# Altium project LED.PrjPcb
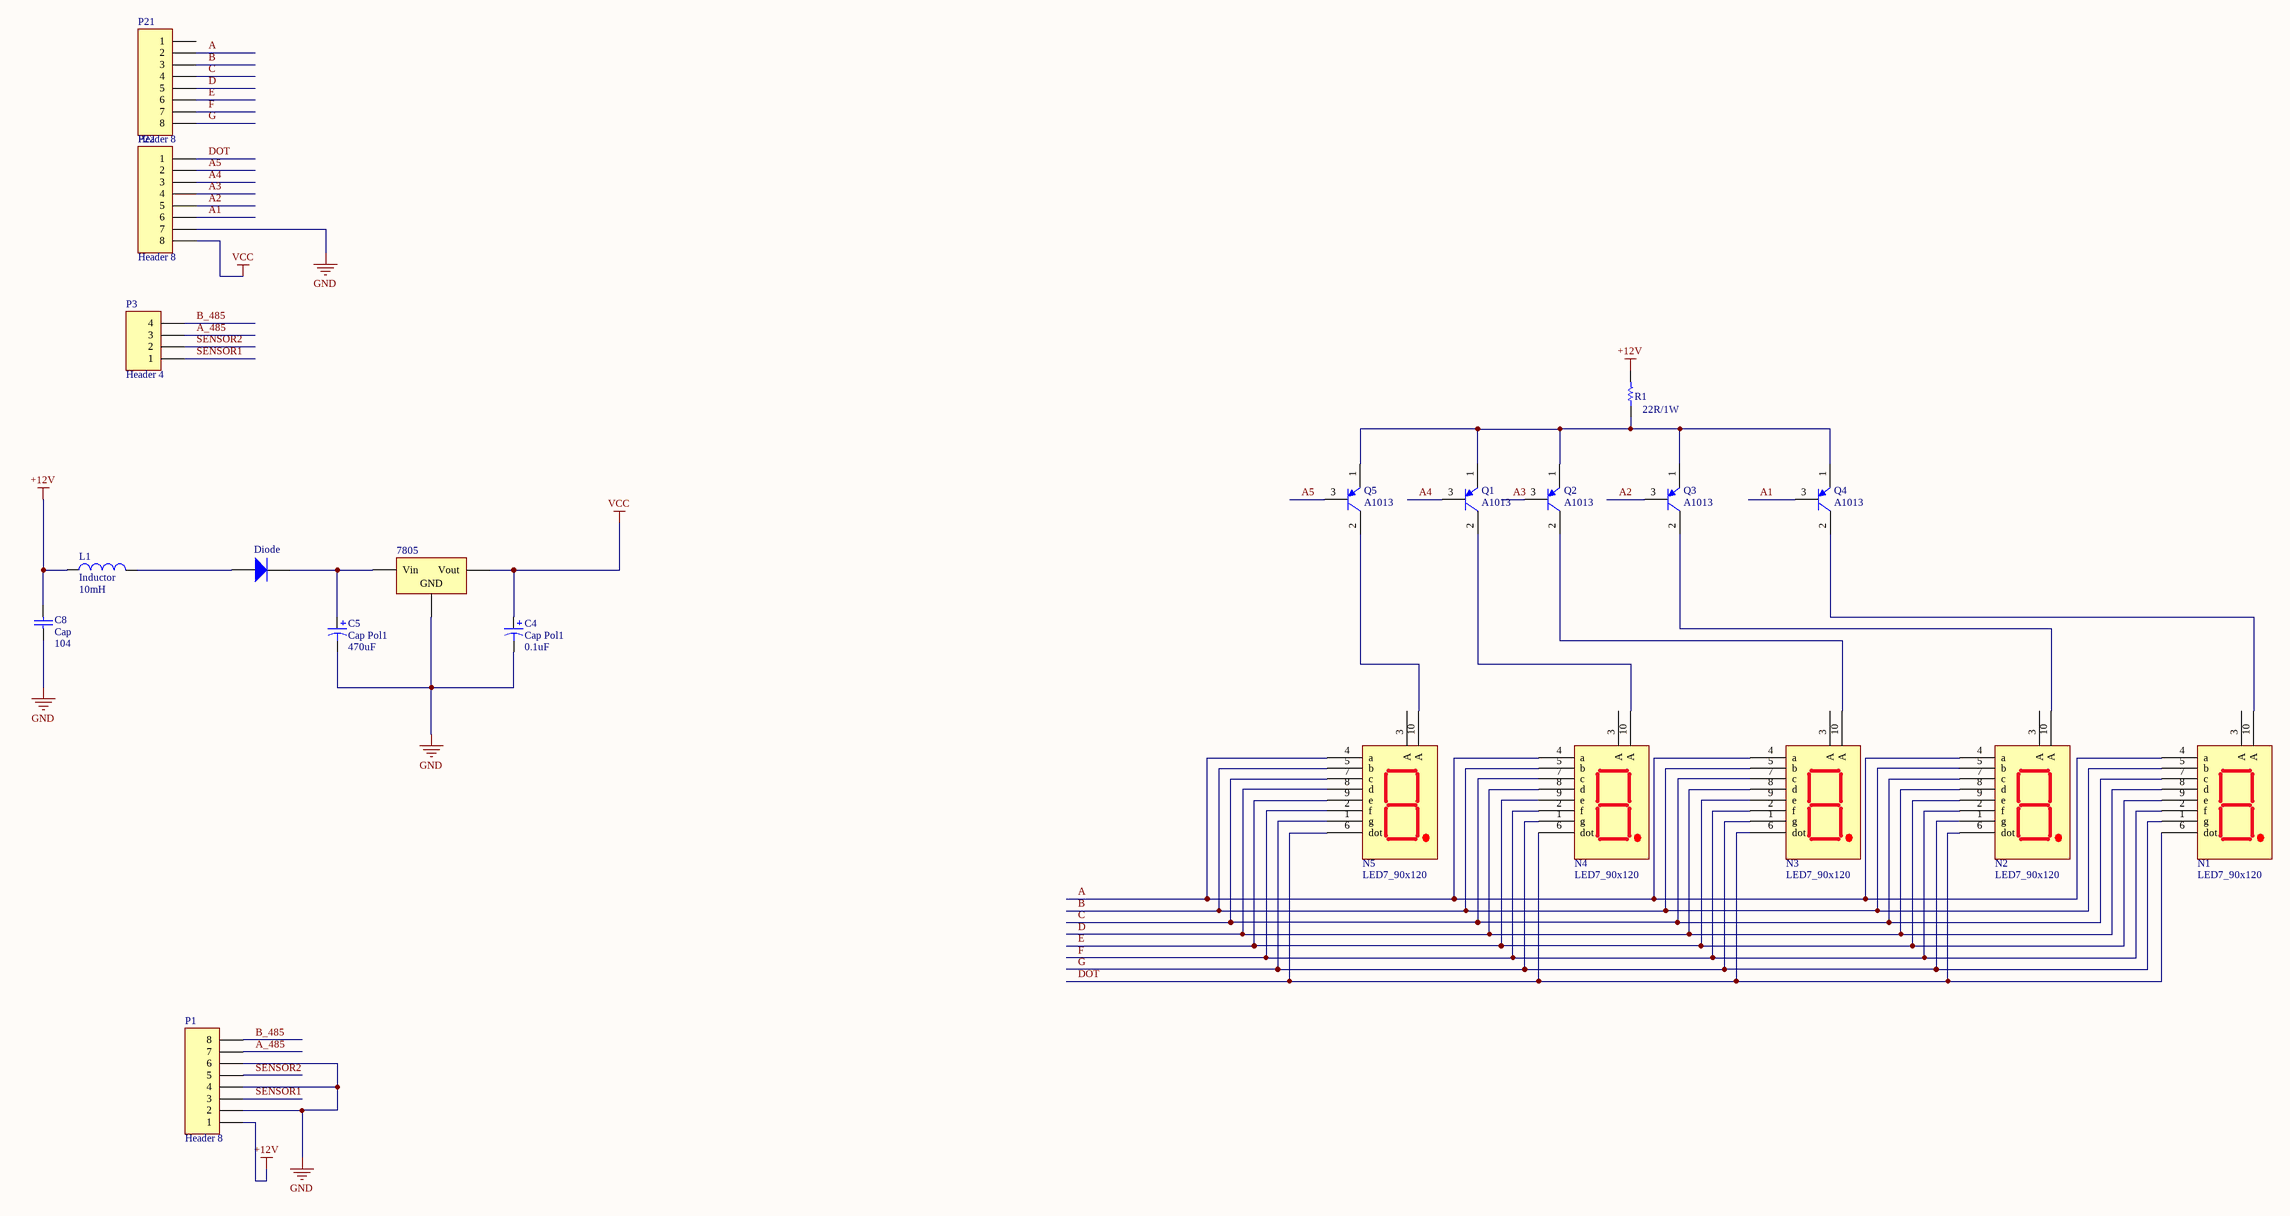
[diagram p0: LED.SchDoc]
1 sheet, 21 parts. Net scope: global (net labels, ports and power ports of the same name join across sheets).
Board file: LED.PcbDoc

## Sheet LED.SchDoc
size A2

### Parts
7805  Volt Reg  [78xxC]  (value not drawn)
C4  Cap Pol1  value 0.1uF  [tu 100uF/50v]
C5  Cap Pol1  value 470uF  [TU 470uF/50V]
C8  Cap  value 104  [tu_gom]
Diode  Diode  [D_2A]  (value not drawn)
L1  Inductor  value 10mH  [R_Nor]
N1  LED7_90x120  [LED7_90x120]
N2  LED7_90x120  [LED7_90x120]
N3  LED7_90x120  [LED7_90x120]
N4  LED7_90x120  [LED7_90x120]
N5  LED7_90x120  [LED7_90x120]
P1  Header 8  [Coc 8]
P3  Header 4  [HDR1X4]
P21  Header 8  [HDR1X8]
P22  Header 8  [HDR1X8]
Q1  A1013  [A1013]
Q2  A1013  [A1013]
Q3  A1013  [A1013]
Q4  A1013  [A1013]
Q5  A1013  [A1013]
R1  22R/1W  [R_CS10R/5W]

### Nets
+12V: C8.2 L1.1 P1.1 R1.2
GND: 7805.2(GND) C4.2 C5.2 C8.1 P1.2 P1.4 P1.6 P22.7
VCC: 7805.3(Vout) C4.1 P22.8
A: N1.4(a) N2.4(a) N3.4(a) N4.4(a) N5.4(a) P21.2
A1: P22.6 Q4.3(B)
A2: P22.5 Q3.3(B)
A3: P22.4 Q2.3(B)
A4: P22.3 Q1.3(B)
A5: P22.2 Q5.3(B)
A_485: P1.7 P3.3
B: N1.5(b) N2.5(b) N3.5(b) N4.5(b) N5.5(b) P21.3
B_485: P1.8 P3.4
C: N1.7(c) N2.7(c) N3.7(c) N4.7(c) N5.7(c) P21.4
D: N1.8(d) N2.8(d) N3.8(d) N4.8(d) N5.8(d) P21.5
DOT: N1.6(dot) N2.6(dot) N3.6(dot) N4.6(dot) N5.6(dot) P22.1
E: N1.9(e) N2.9(e) N3.9(e) N4.9(e) N5.9(e) P21.6
F: N1.2(f) N2.2(f) N3.2(f) N4.2(f) N5.2(f) P21.7
G: N1.1(g) N2.1(g) N3.1(g) N4.1(g) N5.1(g) P21.8
SENSOR1: P1.3 P3.1
SENSOR2: P1.5 P3.2
Net7805_1: 7805.1(Vin) C5.1 Diode.2(K)
NetDiode_1: Diode.1(A) L1.2
NetN1_10: N1.10(A) Q4.2(C)
NetN2_10: N2.10(A) Q3.2(C)
NetN3_10: N3.10(A) Q2.2(C)
NetN4_10: N4.10(A) Q1.2(C)
NetN5_10: N5.10(A) Q5.2(C)
NetQ1_1: Q1.1(E) Q2.1(E) Q3.1(E) Q4.1(E) Q5.1(E) R1.1

Not connected (* = marked no-connect by the designer): N1 3(A); N2 3(A); N3 3(A); N4 3(A); N5 3(A); P21 1

### Library data of the parts
7805 = Volt Reg: Voltage Regulator; Published: 24-Mar-1999; LatestRevisionDate: 29-May-2009; LatestRevisionNote: IPC-7351 Footprint Added.; PackageReference: D2PAK; Publisher: Altium Limited; PackageDescription: 3-Pin Transistor Outline Package 2.54 mm Pitch, 15.1 mm Lead Span
C4 C5 = Cap Pol1: Polarized Capacitor (Radial); Published: 8-Jun-2000; LatestRevisionDate: 17-Jul-2002; LatestRevisionNote: Re-released for DXP Platform.; PackageReference: RB7.6-15; Publisher: Altium Limited
C8 = Ceramic: Capcitor
Diode = Diode: Default Diode; Published: 8-Jun-2000; LatestRevisionDate: 17-Jul-2002; LatestRevisionNote: Re-released for DXP Platform.; PackageVersion: Sep-1996; PackageReference: SMC; Publisher: Altium Limited; Code_JEDEC: DO-214-AB
L1 = Inductor: Code_IEC: 1005; Published: 8-Jun-2000; LatestRevisionDate: 29-May-2009; LatestRevisionNote: IPC-7351 Footprint Added.; PackageReference: 0402-A; Publisher: Altium Limited; PackageDescription: Chip Inductor; Code_JEITA: 0402
P1 P21 P22 = Header 8: Header, 8-Pin; LatestRevisionDate: 17-Jul-2002; LatestRevisionNote: Re-released for DXP Platform.; Publisher: Altium Limited
P3 = Header 4: Header, 4-Pin; LatestRevisionDate: 17-Jul-2002; LatestRevisionNote: Re-released for DXP Platform.; Publisher: Altium Limited
Q1-Q5 = PNP: PNP Bipolar Transistor; Published: 8-Jun-2000; LatestRevisionDate: 29-May-2009; LatestRevisionNote: IPC-7351 Footprint Added.; PackageVersion: Aug-1999; PackageReference: SOT-23B; Publisher: Altium Limited; PackageDescription: 3-Pin SOT-23 Package 0.95 mm Pitch, 2.4 mm Lead Span
R1 = Res